# EAGLE design Program-Counter (EAGLE 9.6.2)
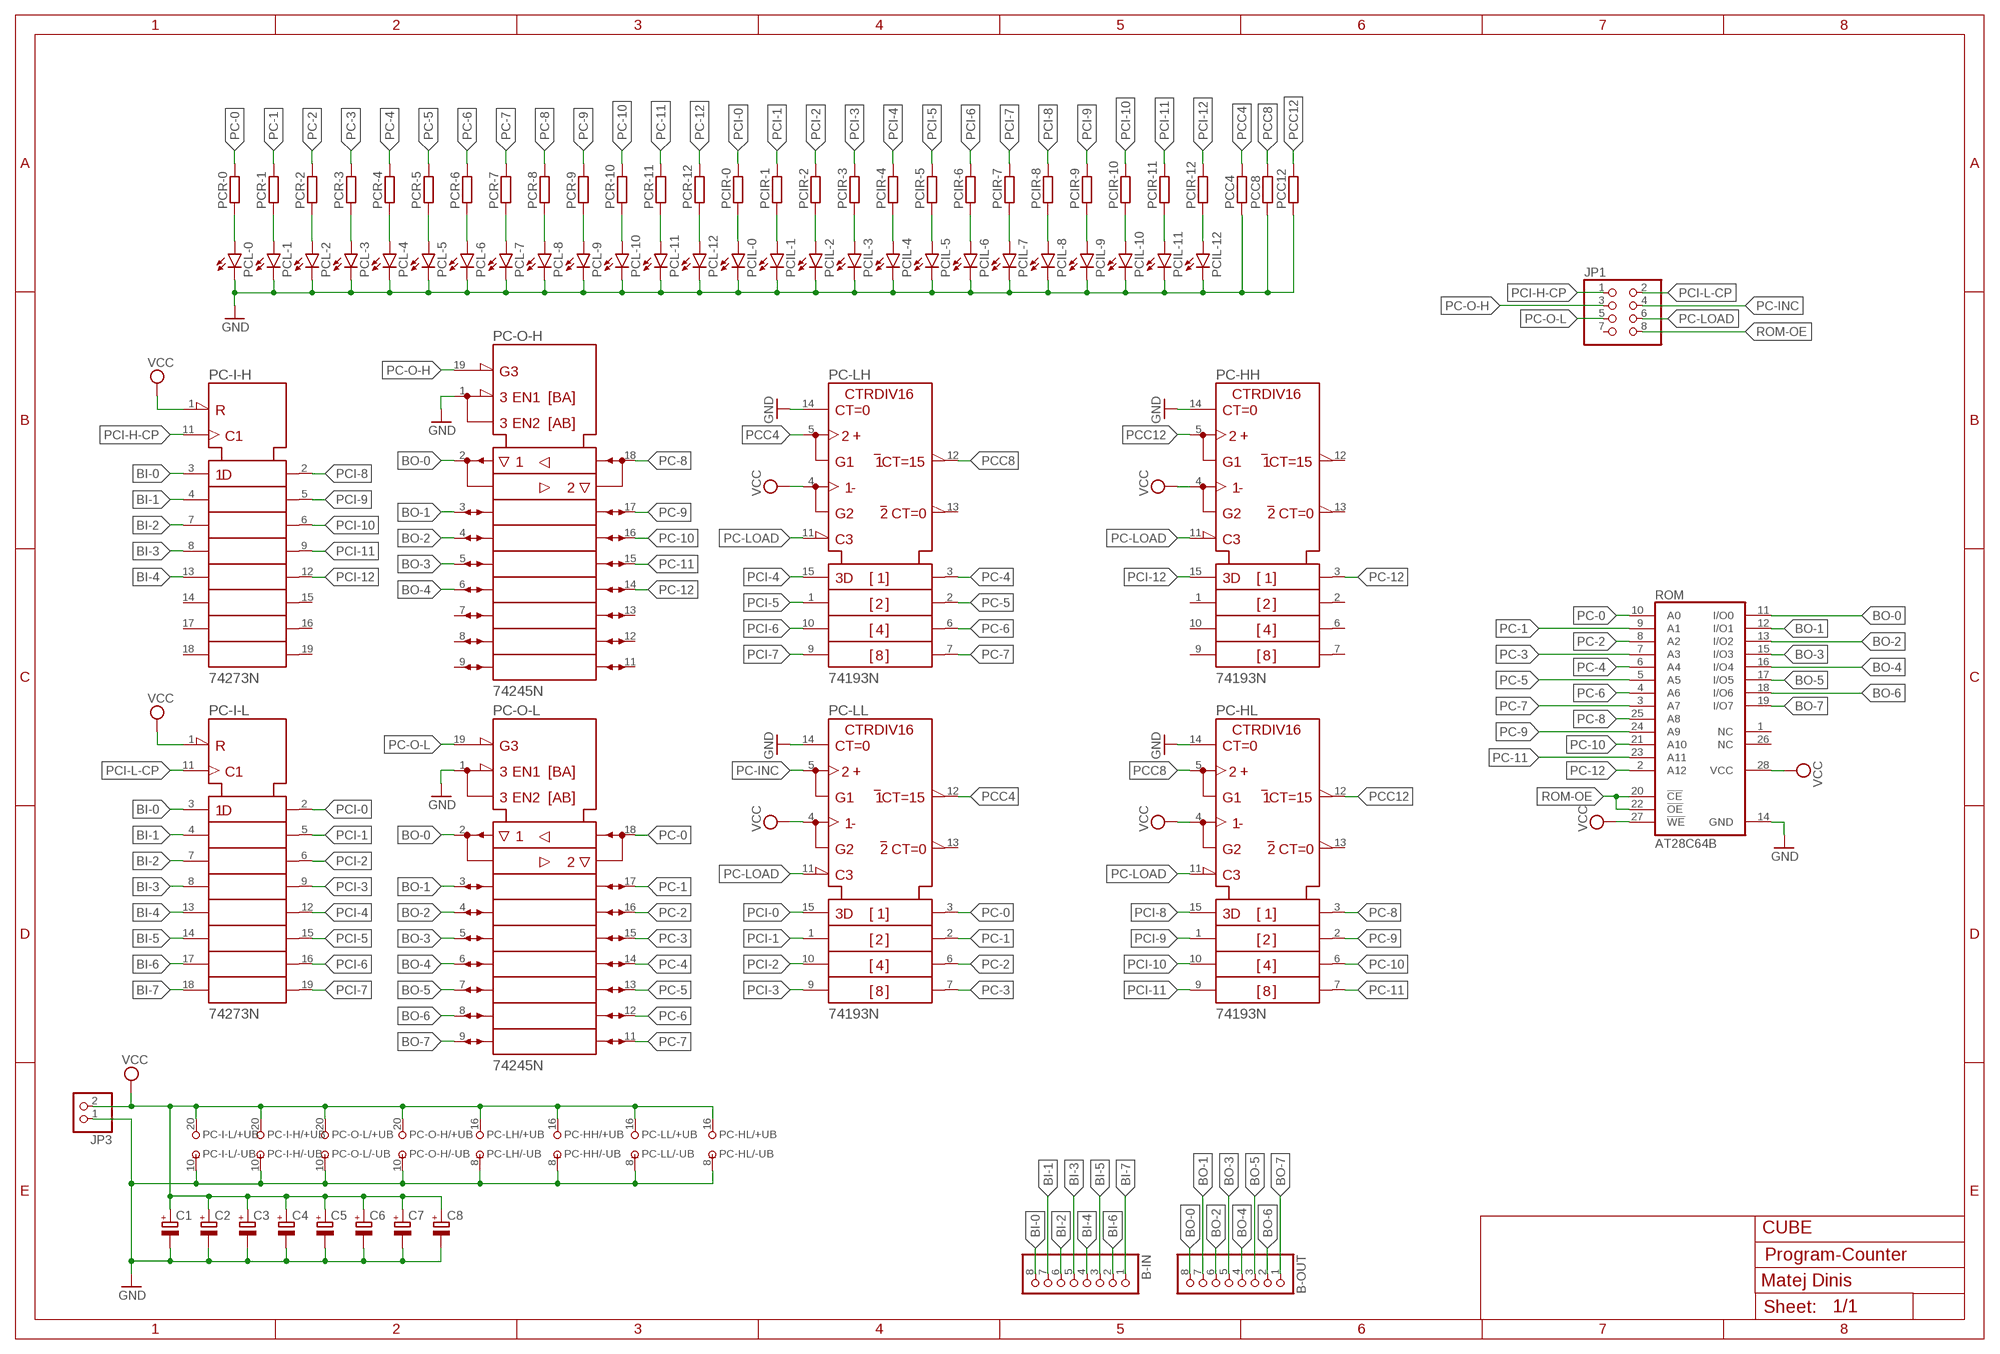
[diagram p0: schematic, sheet 1]

## Parts
B-IN  PINHD-1X8  [1X08]
B-OUT  PINHD-1X8  [1X08]
C1  CPOL-EUE3.5-8  [E3,5-8]
C2  CPOL-EUE3.5-8  [E3,5-8]
C3  CPOL-EUE3.5-8  [E3,5-8]
C4  CPOL-EUE3.5-8  [E3,5-8]
C5  CPOL-EUE3.5-8  [E3,5-8]
C6  CPOL-EUE3.5-8  [E3,5-8]
C7  CPOL-EUE3.5-8  [E3,5-8]
C8  CPOL-EUE3.5-8  [E3,5-8]
JP1  PINHD-2X4  [2X04]
JP3  PINHD-1X2  [1X02]
PC-HH  74193N  [DIL16]
PC-HL  74193N  [DIL16]
PC-I-H  74273N  [DIL20]
PC-I-L  74273N  [DIL20]
PC-LH  74193N  [DIL16]
PC-LL  74193N  [DIL16]
PC-O-H  74245N  [DIL20]
PC-O-L  74245N  [DIL20]
PCC4  R-EU_0207/10  [0207/10]
PCC8  R-EU_0207/10  [0207/10]
PCC12  R-EU_0207/10  [0207/10]
PCIL-0  LED5MM  [LED5MM]
PCIL-1  LED5MM  [LED5MM]
PCIL-2  LED5MM  [LED5MM]
PCIL-3  LED5MM  [LED5MM]
PCIL-4  LED5MM  [LED5MM]
PCIL-5  LED5MM  [LED5MM]
PCIL-6  LED5MM  [LED5MM]
PCIL-7  LED5MM  [LED5MM]
PCIL-8  LED5MM  [LED5MM]
PCIL-9  LED5MM  [LED5MM]
PCIL-10  LED5MM  [LED5MM]
PCIL-11  LED5MM  [LED5MM]
PCIL-12  LED5MM  [LED5MM]
PCIR-0  R-EU_0207/10  [0207/10]
PCIR-1  R-EU_0207/10  [0207/10]
PCIR-2  R-EU_0207/10  [0207/10]
PCIR-3  R-EU_0207/10  [0207/10]
PCIR-4  R-EU_0207/10  [0207/10]
PCIR-5  R-EU_0207/10  [0207/10]
PCIR-6  R-EU_0207/10  [0207/10]
PCIR-7  R-EU_0207/10  [0207/10]
PCIR-8  R-EU_0207/10  [0207/10]
PCIR-9  R-EU_0207/10  [0207/10]
PCIR-10  R-EU_0207/10  [0207/10]
PCIR-11  R-EU_0207/10  [0207/10]
PCIR-12  R-EU_0207/10  [0207/10]
PCL-0  LED5MM  [LED5MM]
PCL-1  LED5MM  [LED5MM]
PCL-2  LED5MM  [LED5MM]
PCL-3  LED5MM  [LED5MM]
PCL-4  LED5MM  [LED5MM]
PCL-5  LED5MM  [LED5MM]
PCL-6  LED5MM  [LED5MM]
PCL-7  LED5MM  [LED5MM]
PCL-8  LED5MM  [LED5MM]
PCL-9  LED5MM  [LED5MM]
PCL-10  LED5MM  [LED5MM]
PCL-11  LED5MM  [LED5MM]
PCL-12  LED5MM  [LED5MM]
PCR-0  R-EU_0207/10  [0207/10]
PCR-1  R-EU_0207/10  [0207/10]
PCR-2  R-EU_0207/10  [0207/10]
PCR-3  R-EU_0207/10  [0207/10]
PCR-4  R-EU_0207/10  [0207/10]
PCR-5  R-EU_0207/10  [0207/10]
PCR-6  R-EU_0207/10  [0207/10]
PCR-7  R-EU_0207/10  [0207/10]
PCR-8  R-EU_0207/10  [0207/10]
PCR-9  R-EU_0207/10  [0207/10]
PCR-10  R-EU_0207/10  [0207/10]
PCR-11  R-EU_0207/10  [0207/10]
PCR-12  R-EU_0207/10  [0207/10]
ROM  AT28C64B  28C64C  [DIL28-6]

## Nets
BI-0: B-IN.8 PC-I-H.3(1D) PC-I-L.3(1D)
BI-1: B-IN.7 PC-I-H.4(2D) PC-I-L.4(2D)
BI-2: B-IN.6 PC-I-H.7(3D) PC-I-L.7(3D)
BI-3: B-IN.5 PC-I-H.8(4D) PC-I-L.8(4D)
BI-4: B-IN.4 PC-I-H.13(5D) PC-I-L.13(5D)
BI-5: B-IN.3 PC-I-L.14(6D)
BI-6: B-IN.2 PC-I-L.17(7D)
BI-7: B-IN.1 PC-I-L.18(8D)
BO-0: B-OUT.8 PC-O-H.2(A1) PC-O-L.2(A1) ROM.11(I/O0)
BO-1: B-OUT.7 PC-O-H.3(A2) PC-O-L.3(A2) ROM.12(I/O1)
BO-2: B-OUT.6 PC-O-H.4(A3) PC-O-L.4(A3) ROM.13(I/O2)
BO-3: B-OUT.5 PC-O-H.5(A4) PC-O-L.5(A4) ROM.15(I/O3)
BO-4: B-OUT.4 PC-O-H.6(A5) PC-O-L.6(A5) ROM.16(I/O4)
BO-5: B-OUT.3 PC-O-L.7(A6) ROM.17(I/O5)
BO-6: B-OUT.2 PC-O-L.8(A7) ROM.18(I/O6)
BO-7: B-OUT.1 PC-O-L.9(A8) ROM.19(I/O7)
GND: C1.- C2.- C3.- C4.- C5.- C6.- C7.- C8.- JP3.1 PC-HH.8(-UB) PC-HH.14(CLR) PC-HL.8(-UB) PC-HL.14(CLR) PC-I-H.10(-UB) PC-I-L.10(-UB) PC-LH.8(-UB) PC-LH.14(CLR) PC-LL.8(-UB) PC-LL.14(CLR) PC-O-H.1(DIR) PC-O-H.10(-UB) PC-O-L.1(DIR) PC-O-L.10(-UB) PCC4.1 PCC8.1 PCC12.1 PCIL-0.K(C) PCIL-1.K(C) PCIL-2.K(C) PCIL-3.K(C) PCIL-4.K(C) PCIL-5.K(C) PCIL-6.K(C) PCIL-7.K(C) PCIL-8.K(C) PCIL-9.K(C) PCIL-10.K(C) PCIL-11.K(C) PCIL-12.K(C) PCL-0.K(C) PCL-1.K(C) PCL-2.K(C) PCL-3.K(C) PCL-4.K(C) PCL-5.K(C) PCL-6.K(C) PCL-7.K(C) PCL-8.K(C) PCL-9.K(C) PCL-10.K(C) PCL-11.K(C) PCL-12.K(C) ROM.14(GND)
N$1: PCL-0.A PCR-0.1
N$4: PCL-1.A PCR-1.1
N$7: PCL-2.A PCR-2.1
N$10: PCL-3.A PCR-3.1
N$13: PCL-4.A PCR-4.1
N$16: PCL-5.A PCR-5.1
N$21: PCL-6.A PCR-6.1
N$24: PCL-7.A PCR-7.1
N$27: PCL-8.A PCR-8.1
N$30: PCL-9.A PCR-9.1
N$33: PCL-10.A PCR-10.1
N$38: PCL-11.A PCR-11.1
N$41: PCL-12.A PCR-12.1
N$44: PCIL-0.A PCIR-0.1
N$47: PCIL-1.A PCIR-1.1
N$50: PCIL-2.A PCIR-2.1
N$55: PCIL-3.A PCIR-3.1
N$58: PCIL-4.A PCIR-4.1
N$61: PCIL-5.A PCIR-5.1
N$64: PCIL-6.A PCIR-6.1
N$67: PCIL-7.A PCIR-7.1
N$70: PCIL-8.A PCIR-8.1
N$73: PCIL-9.A PCIR-9.1
N$76: PCIL-10.A PCIR-10.1
N$79: PCIL-11.A PCIR-11.1
N$82: PCIL-12.A PCIR-12.1
PC-0: PC-LL.3(QA) PC-O-L.18(B1) PCR-0.2 ROM.10(A0)
PC-1: PC-LL.2(QB) PC-O-L.17(B2) PCR-1.2 ROM.9(A1)
PC-2: PC-LL.6(QC) PC-O-L.16(B3) PCR-2.2 ROM.8(A2)
PC-3: PC-LL.7(QD) PC-O-L.15(B4) PCR-3.2 ROM.7(A3)
PC-4: PC-LH.3(QA) PC-O-L.14(B5) PCR-4.2 ROM.6(A4)
PC-5: PC-LH.2(QB) PC-O-L.13(B6) PCR-5.2 ROM.5(A5)
PC-6: PC-LH.6(QC) PC-O-L.12(B7) PCR-6.2 ROM.4(A6)
PC-7: PC-LH.7(QD) PC-O-L.11(B8) PCR-7.2 ROM.3(A7)
PC-8: PC-HL.3(QA) PC-O-H.18(B1) PCR-8.2 ROM.25(A8)
PC-9: PC-HL.2(QB) PC-O-H.17(B2) PCR-9.2 ROM.24(A9)
PC-10: PC-HL.6(QC) PC-O-H.16(B3) PCR-10.2 ROM.21(A10)
PC-11: PC-HL.7(QD) PC-O-H.15(B4) PCR-11.2 ROM.23(A11)
PC-12: PC-HH.3(QA) PC-O-H.14(B5) PCR-12.2 ROM.2(A12)
PC-INC: JP1.4 PC-LL.5(UP)
PC-LOAD: JP1.6 PC-HH.11(!LOAD) PC-HL.11(!LOAD) PC-LH.11(!LOAD) PC-LL.11(!LOAD)
PC-O-H: JP1.3 PC-O-H.19(!G)
PC-O-L: JP1.5 PC-O-L.19(!G)
PCC4: PC-LH.5(UP) PC-LL.12(!CO) PCC4.2
PCC8: PC-HL.5(UP) PC-LH.12(!CO) PCC8.2
PCC12: PC-HH.5(UP) PC-HL.12(!CO) PCC12.2
PCI-0: PC-I-L.2(1Q) PC-LL.15(A) PCIR-0.2
PCI-1: PC-I-L.5(2Q) PC-LL.1(B) PCIR-1.2
PCI-2: PC-I-L.6(3Q) PC-LL.10(C) PCIR-2.2
PCI-3: PC-I-L.9(4Q) PC-LL.9(D) PCIR-3.2
PCI-4: PC-I-L.12(5Q) PC-LH.15(A) PCIR-4.2
PCI-5: PC-I-L.15(6Q) PC-LH.1(B) PCIR-5.2
PCI-6: PC-I-L.16(7Q) PC-LH.10(C) PCIR-6.2
PCI-7: PC-I-L.19(8Q) PC-LH.9(D) PCIR-7.2
PCI-8: PC-HL.15(A) PC-I-H.2(1Q) PCIR-8.2
PCI-9: PC-HL.1(B) PC-I-H.5(2Q) PCIR-9.2
PCI-10: PC-HL.10(C) PC-I-H.6(3Q) PCIR-10.2
PCI-11: PC-HL.9(D) PC-I-H.9(4Q) PCIR-11.2
PCI-12: PC-HH.15(A) PC-I-H.12(5Q) PCIR-12.2
PCI-H-CP: JP1.1 PC-I-H.11(CLK)
PCI-L-CP: JP1.2 PC-I-L.11(CLK)
ROM-OE: JP1.8 ROM.20(!CE) ROM.22(!OE)
VCC: C1.+ C2.+ C3.+ C4.+ C5.+ C6.+ C7.+ C8.+ JP3.2 PC-HH.4(DOWN) PC-HH.16(+UB) PC-HL.4(DOWN) PC-HL.16(+UB) PC-I-H.1(!CLR) PC-I-H.20(+UB) PC-I-L.1(!CLR) PC-I-L.20(+UB) PC-LH.4(DOWN) PC-LH.16(+UB) PC-LL.4(DOWN) PC-LL.16(+UB) PC-O-H.20(+UB) PC-O-L.20(+UB) ROM.27(!WE) ROM.28(VCC)
Unconnected: JP1.7 PC-HH.1(B) PC-HH.2(QB) PC-HH.6(QC) PC-HH.7(QD) PC-HH.9(D) PC-HH.10(C) PC-HH.12(!CO) PC-HH.13(!BO) PC-HL.13(!BO) PC-I-H.14(6D) PC-I-H.15(6Q) PC-I-H.16(7Q) PC-I-H.17(7D) PC-I-H.18(8D) PC-I-H.19(8Q) PC-LH.13(!BO) PC-LL.13(!BO) PC-O-H.7(A6) PC-O-H.8(A7) PC-O-H.9(A8) PC-O-H.11(B8) PC-O-H.12(B7) PC-O-H.13(B6) ROM.1(NC) ROM.26(NC)

## Notes on the sheet
- CUBE
- Matej Dinis

## Library data of the parts
B-IN B-OUT = pinhead:PINHD-1X8: PIN HEADER
C1-C8 = rcl:CPOL-EU: POLARIZED CAPACITOR, European symbol; SPICEPREFIX: C
JP1 = pinhead:PINHD-2X4: PIN HEADER
JP3 = pinhead:PINHD-1X2: PIN HEADER
PC-HH PC-HL PC-LH PC-LL = 74ttl-din:74*193: Synchronus 4-bit up down COUNTER
PC-I-H PC-I-L = 74ttl-din:74*273: Octal D type FLIP FLOP, clear
PC-O-H PC-O-L = 74ttl-din:74*245: Octal BUS TRANSCEIVER, 3-state
PCC4 PCC8 PCC12 PCIR-0 PCIR-1-PCIR-12 PCR-0 PCR-1-PCR-12 = rcl:R-EU_: RESISTOR, European symbol; SPICEPREFIX: R
PCIL-0 PCIL-1-PCIL-12 PCL-0 PCL-1-PCL-12 = led:LED: LED OSRAM: - CHIPLED LG R971, LG N971, LY N971, LG Q971, LY Q971, LO R971, LY R971 LH N974, LH R974 LS Q976, LO Q976, LY Q976 LO Q996 - Hyper CHIPLED LW Q18S LB Q993, LB Q99A, LB R99A - SideLED LS A670, LO A670, LY A670, LG A670, LP A670 LB A673, LV A673, LT A673, LW A673 LH A674 LY A675 LS A676, LA A676, LO A676, LY A676, LW A676 LS A679, LY A679, LG A679 - Hyper Micro SIDELED® LS Y876, LA Y876, LO Y876, LY Y876 LT Y87S - SmartLED LW L88C, LW L88S LB L89C, LB L89S, LG L890 LS L89K, LO L89K, LY L89K LS L896, LA L896, LO L896, LY L896 - TOPLED LS T670, LO T670, LY T670, LG T670, LP T670 LSG T670, LSP T670, LSY T670, LOP T670, LYG T670 LG T671, LOG T671, LSG T671 LB T673, LV T673, LT T673, LW T673 LH T674 LS T676, LA T676, LO T676, LY T676, LB T676, LH T676, LSB T676, LW T676 LB T67C, LV T67C, LT T67C, LS T67K, LO T67K, LY T67K, LW E67C LS E67B, LA E67B, LO E67B, LY E67B, LB E67C, LV E67C, LT E67C LW T67C LS T679, LY T679, LG T679 LS T770, LO T770, LY T770, LG T770, LP T770 LB T773, LV T773, LT T773, LW T773 LH T774 LS E675, LA E675, LY E675, LS T675 LS T776, LA T776, LO T776, LY T776, LB T776 LHGB T686 LT T68C, LB T68C - Hyper Mini TOPLED® LB M676 - Mini TOPLED Santana® LG M470 LS M47K, LO M47K, LY M47K Source: http://www.osram.convergy.de LUXEON: - LUMILED® LXK2-PW12-R00, LXK2-PW12-S00, LXK2-PW14-U00, LXK2-PW14-V00 LXK2-PM12-R00, LXK2-PM12-S00, LXK2-PM14-U00 LXK2-PE12-Q00, LXK2-PE12-R00, LXK2-PE12-S00, LXK2-PE14-T00, LXK2-PE14-U00 LXK2-PB12-K00, LXK2-PB12-L00, LXK2-PB12-M00, LXK2-PB14-N00, LXK2-PB14-P00, LXK2-PB14-Q00 LXK2-PR12-L00, LXK2-PR12-M00, LXK2-PR14-Q00, LXK2-PR14-R00 LXK2-PD12-Q00, LXK2-PD12-R00, LXK2-PD12-S00 LXK2-PH12-R00, LXK2-PH12-S00 LXK2-PL12-P00, LXK2-PL12-Q00, LXK2-PL12-R00 Source: www.luxeon.com KINGBRIGHT: KA-3528ASYC Source: www.kingbright.com
ROM = memory-nec:28C64C: MEMORY; MPN: AT28C64B-15PU; OC_FARNELL: 1095784; OC_NEWARK: 96K6557

## Board
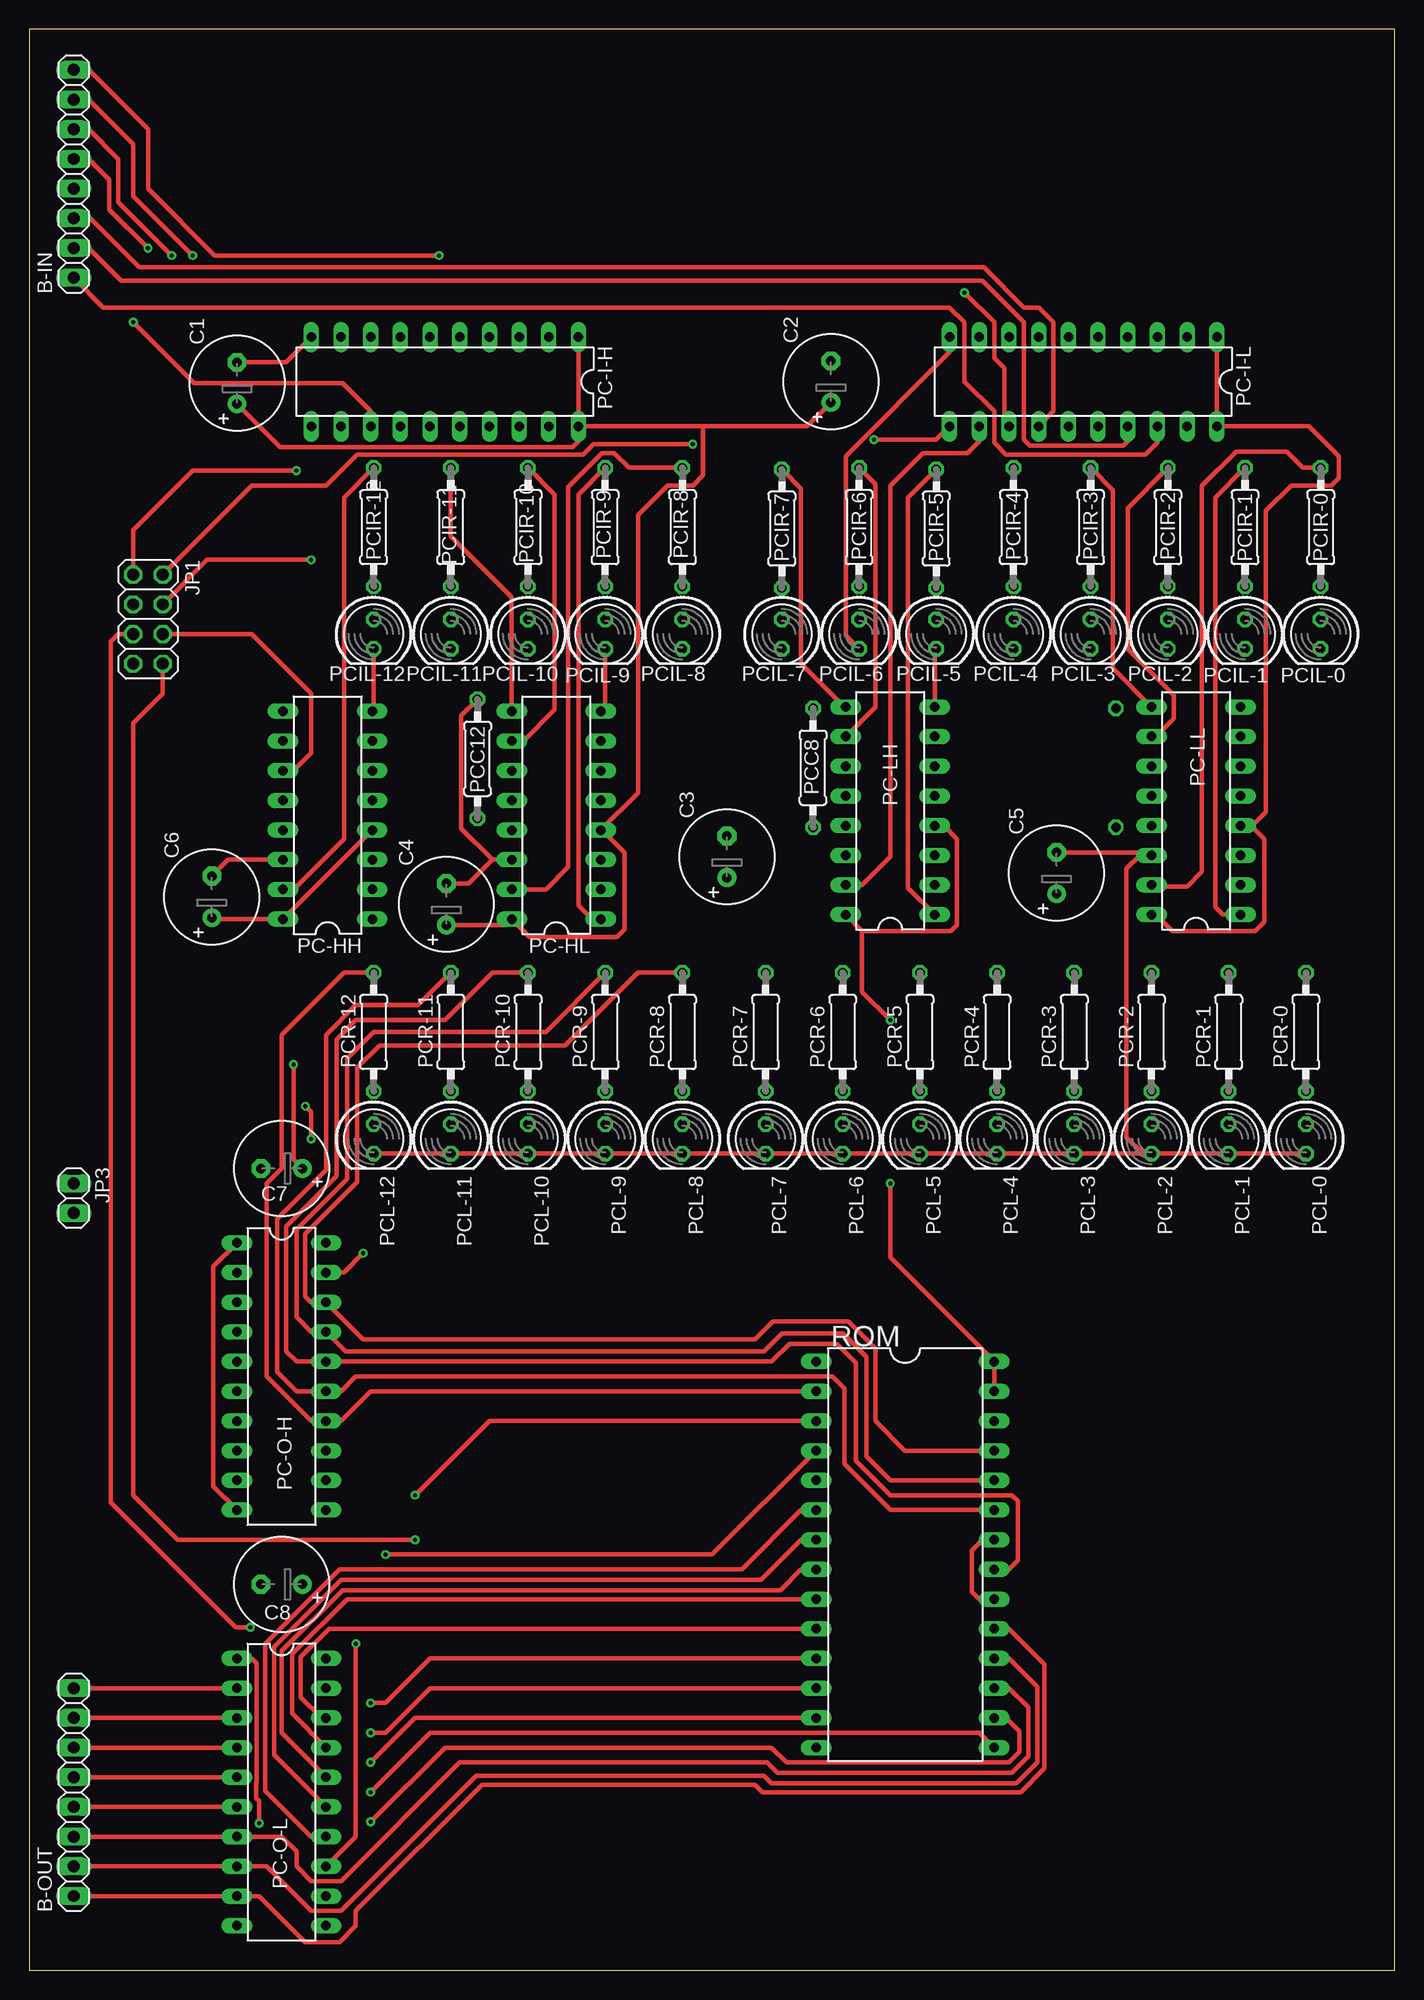
[diagram p1: board, top side]
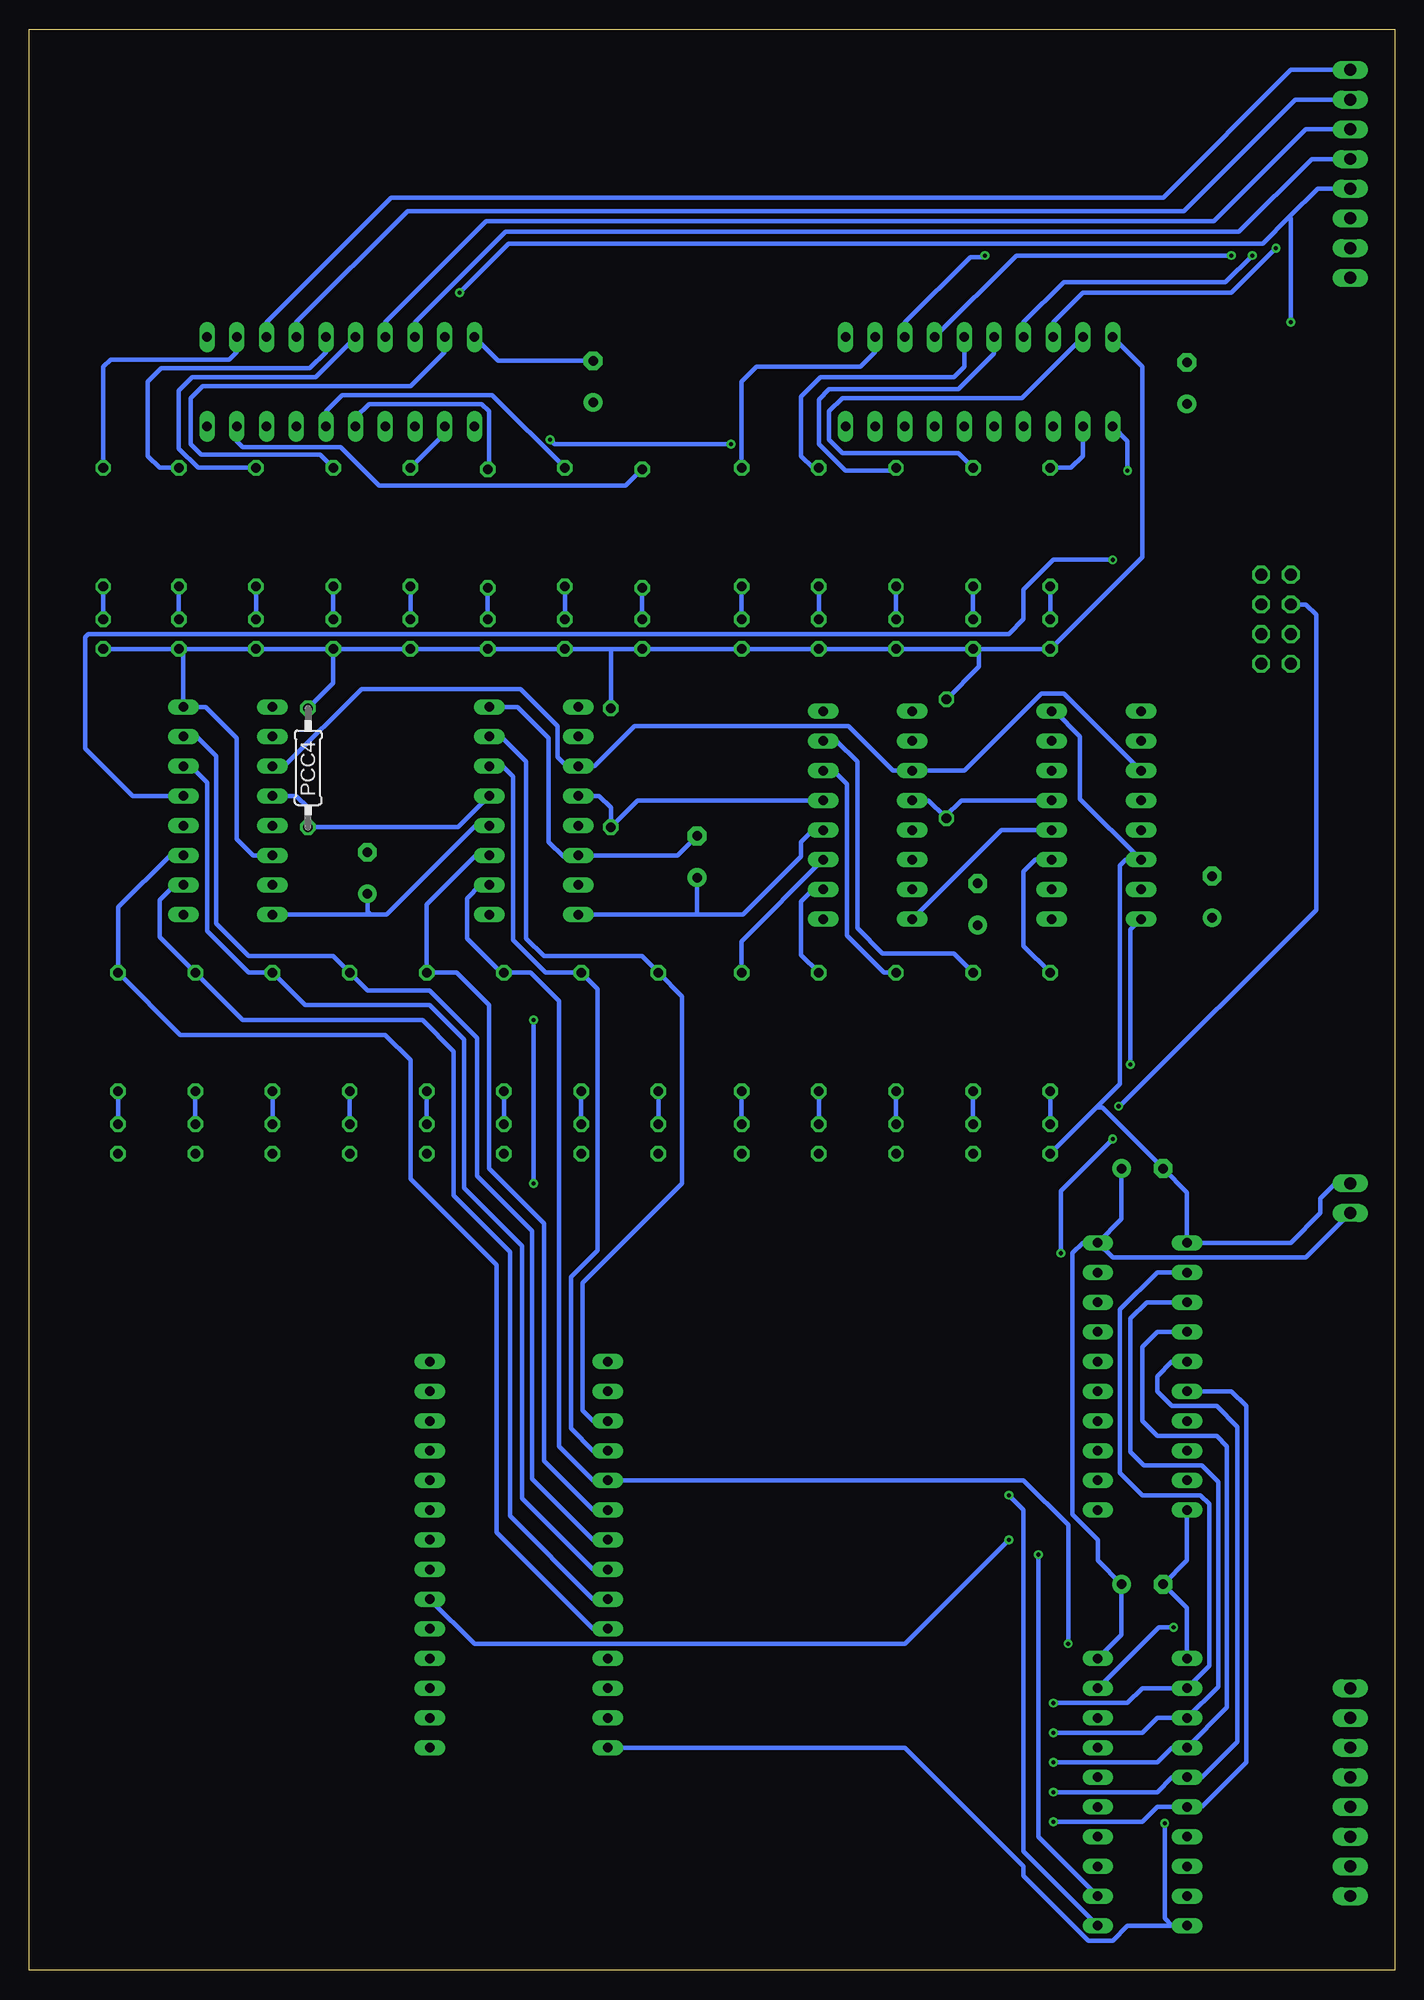
[diagram p2: board, bottom side, seen from below]

Size 116.82 x 166.04 mm. Coordinates in mm from the lower left corner, seen from the top.
Outline: 0,0 116.82,0 116.82,166.04 0,166.04 0,0
Copper layers (1*16): Top 0.035mm / dielectric 1.5mm / Bottom 0.035mm
Design rules "default": minimum track width 6mil, minimum drill 0.35mm, track to track 6mil, track to pad 6mil, pad to pad 6mil, via to via 6mil, smd to smd 6mil, copper to edge 40mil, drill to drill 6mil, minimum pad ring 10mil, minimum via ring 8mil, stop-mask expansion 4mil, vias tented up to drill 0mil, thermal gap 10mil

### Footprints (pad centres in the part's own frame; a part is rotated, then mirrored left to right if it is on the bottom)
1X08 = drill 1.016 long: 1 -8.89,0; 2 -6.35,0; 3 -3.81,0; 4 -1.27,0; 5 1.27,0; 6 3.81,0; 7 6.35,0; 8 8.89,0
E3,5-8 = drill 0.813 pad 1.6: + -1.778,0 | drill 0.813 pad 1.6 octagon: - 1.778,0
2X04 = drill 1.016 octagon: 1 -3.81,-1.27; 2 -3.81,1.27; 3 -1.27,-1.27; 4 -1.27,1.27; 5 1.27,-1.27; 6 1.27,1.27; 7 3.81,-1.27; 8 3.81,1.27
1X02 = drill 1.016 long: 1 -1.27,0; 2 1.27,0
DIL16 = drill 0.813 long: 1 -8.89,-3.81; 2 -6.35,-3.81; 3 -3.81,-3.81; 4 -1.27,-3.81; 5 1.27,-3.81; 6 3.81,-3.81; 7 6.35,-3.81; 8 8.89,-3.81; 9 8.89,3.81; 10 6.35,3.81; 11 3.81,3.81; 12 1.27,3.81; 13 -1.27,3.81; 14 -3.81,3.81; 15 -6.35,3.81; 16 -8.89,3.81
DIL20 = drill 0.813 long: 1 -11.43,-3.81; 2 -8.89,-3.81; 3 -6.35,-3.81; 4 -3.81,-3.81; 5 -1.27,-3.81; 6 1.27,-3.81; 7 3.81,-3.81; 8 6.35,-3.81; 9 8.89,-3.81; 10 11.43,-3.81; 11 11.43,3.81; 12 8.89,3.81; 13 6.35,3.81; 14 3.81,3.81; 15 1.27,3.81; 16 -1.27,3.81; 17 -3.81,3.81; 18 -6.35,3.81; 19 -8.89,3.81; 20 -11.43,3.81
0207/10 = drill 0.813 octagon: 1 -5.08,0; 2 5.08,0
LED5MM = drill 0.813 octagon: A -1.27,0; K 1.27,0
DIL28-6 = drill 0.813 long: 1 -16.51,-7.62; 2 -13.97,-7.62; 3 -11.43,-7.62; 4 -8.89,-7.62; 5 -6.35,-7.62; 6 -3.81,-7.62; 7 -1.27,-7.62; 8 1.27,-7.62; 9 3.81,-7.62; 10 6.35,-7.62; 11 8.89,-7.62; 12 11.43,-7.62; 13 13.97,-7.62; 14 16.51,-7.62; 15 16.51,7.62; 16 13.97,7.62; 17 11.43,7.62; 18 8.89,7.62; 19 6.35,7.62; 20 3.81,7.62; 21 1.27,7.62; 22 -1.27,7.62; 23 -3.81,7.62; 24 -6.35,7.62; 25 -8.89,7.62; 26 -11.43,7.62; 27 -13.97,7.62; 28 -16.51,7.62

### Placement (x,y rotation side)
B-IN  3.81,153.67 90 top
B-OUT  3.81,15.24 90 top
C1  17.78,135.76 90 top
C2  68.58,135.89 90 top
C3  59.69,95.25 90 top
C4  35.69,91.19 90 top
C5  87.88,93.85 90 top
C6  15.62,91.82 90 top
C7  21.59,68.58 180 top
C8  21.59,33.02 180 top
JP1  10.16,115.57 270 top
JP3  3.81,66.04 270 top
PC-HH  25.53,98.81 90 top
PC-HL  45.09,98.81 90 top
PC-I-H  35.56,135.89 180 top
PC-I-L  90.17,135.89 180 top
PC-LH  73.66,99.19 90 top
PC-LL  99.82,99.19 90 top
PC-O-H  21.59,50.8 270 top
PC-O-L  21.59,15.24 270 top
PCC4  92.96,102.87 270 bottom
PCC8  67.06,102.87 270 top
PCC12  38.35,103.63 270 top
PCIL-0  110.49,114.3 270 top
PCIL-1  104.01,114.3 270 top
PCIL-2  97.41,114.3 270 top
PCIL-3  90.81,114.3 270 top
PCIL-4  84.2,114.3 270 top
PCIL-5  77.6,114.3 270 top
PCIL-6  70.99,114.3 270 top
PCIL-7  64.39,114.3 270 top
PCIL-8  55.88,114.3 270 top
PCIL-9  49.28,114.3 270 top
PCIL-10  42.67,114.3 270 top
PCIL-11  36.07,114.3 270 top
PCIL-12  29.46,114.3 270 top
PCIR-0  110.49,123.44 90 top
PCIR-1  104.01,123.44 90 top
PCIR-2  97.41,123.44 90 top
PCIR-3  90.81,123.44 90 top
PCIR-4  84.2,123.44 90 top
PCIR-5  77.6,123.32 90 top
PCIR-6  70.99,123.44 90 top
PCIR-7  64.39,123.32 90 top
PCIR-8  55.88,123.44 90 top
PCIR-9  49.28,123.44 90 top
PCIR-10  42.67,123.44 90 top
PCIR-11  36.07,123.44 90 top
PCIR-12  29.46,123.44 90 top
PCL-0  109.22,71.12 270 top
PCL-1  102.62,71.12 270 top
PCL-2  96.01,71.12 270 top
PCL-3  89.41,71.12 270 top
PCL-4  82.8,71.12 270 top
PCL-5  76.2,71.12 270 top
PCL-6  69.6,71.12 270 top
PCL-7  62.99,71.12 270 top
PCL-8  55.88,71.12 270 top
PCL-9  49.28,71.12 270 top
PCL-10  42.67,71.12 270 top
PCL-11  36.07,71.12 270 top
PCL-12  29.46,71.12 270 top
PCR-0  109.22,80.26 90 top
PCR-1  102.62,80.26 90 top
PCR-2  96.01,80.26 90 top
PCR-3  89.41,80.26 90 top
PCR-4  82.8,80.26 90 top
PCR-5  76.2,80.26 90 top
PCR-6  69.6,80.26 90 top
PCR-7  62.99,80.26 90 top
PCR-8  55.88,80.26 90 top
PCR-9  49.28,80.26 90 top
PCR-10  42.67,80.26 90 top
PCR-11  36.07,80.26 90 top
PCR-12  29.46,80.26 90 top
ROM  74.93,35.56 270 top

### Tracks (layer width: path | path; a pad name or v marks a point on that pad's centre or on a via)
BI-0  (via drill 0.35)
  Top 0.4: v35.05,146.69 15.88,146.69 10.16,152.4 10.16,157.48 5.08,162.56 B-IN.8
  Bottom 0.4: B-IN.8 8.89,162.56 19.81,151.64 85.85,151.64 96.52,140.97 PC-I-L.3 | PC-I-H.3 41.91,140.97 36.32,146.56 35.18,146.56 v35.05,146.69
BI-1  (via drill 0.35)
  Top 0.4: B-IN.7 5.08,160.02 8.89,156.21 8.89,151.76 v13.97,146.69
  Bottom 0.4: PC-I-L.4 93.98,140.97 84.45,150.5 18.03,150.5 8.51,160.02 B-IN.7 | v13.97,146.69 32.38,146.69 PC-I-H.4
BI-2  (via drill 0.35)
  Top 0.4: v12.19,146.69 7.62,151.26 7.62,154.94 5.08,157.48 B-IN.6
  Bottom 0.4: B-IN.6 7.62,157.48 15.49,149.61 77.72,149.61 86.36,140.97 PC-I-L.7 | PC-I-H.7 31.75,140.97 28.32,144.4 14.48,144.4 v12.19,146.69
BI-3  (via drill 0.35)
  Top 0.4: B-IN.5 5.08,154.94 6.86,153.16 6.86,150.62 v10.16,147.32
  Bottom 0.4: PC-I-L.8 83.82,140.97 76.07,148.72 13.34,148.72 7.11,154.94 B-IN.5 | PC-I-H.8 29.21,140.97 26.67,143.51 13.97,143.51 v10.16,147.32
BI-4  (via drill 0.35)
  Top 0.4: PC-I-L.13 83.44,132.46 83.44,137.03 82.55,137.92 82.55,140.97 v80.01,143.51 | PC-I-H.13 29.21,133.35 26.8,135.76 14.1,135.76 v8.89,140.97
  Bottom 0.4: B-IN.4 6.6,152.4 9.02,149.99 | v80.01,143.51 75.82,147.7 11.3,147.7 9.02,149.99 | v8.89,140.97 8.89,149.86 9.02,149.99
BI-5
  Top 0.4: PC-I-L.14 87.63,133.35 87.63,140.97 86.36,142.24 85.09,142.24 81.66,145.67 9.4,145.67 5.21,149.86 B-IN.3
BI-6
  Top 0.4: PC-I-L.17 93.98,130.81 93.6,130.43 91.88,130.43 91.86,130.41 85.62,130.41 85.09,130.94 85.09,140.97 81.53,144.53 7.87,144.53 5.08,147.32 B-IN.2
BI-7
  Top 0.4: B-IN.1 6.35,142.24 78.74,142.24 80.01,140.97 80.01,135.89 82.55,133.35 82.55,130.68 83.57,129.67 95.5,129.67 96.52,130.68 PC-I-L.18
BO-0  (via drill 0.35)
  Top 0.4: v29.21,22.86 30.48,22.86 34.29,26.67 ROM.11 | PC-O-L.2 B-OUT.8
  Bottom 0.4: v29.21,22.86 22.86,22.86 21.59,24.13 PC-O-L.2 15.88,26.04 15.88,39.88 16.64,40.64 21.59,40.64 23.5,42.55 23.5,56.52 20.32,59.69 PC-O-H.2
BO-1  (via drill 0.35)
  Top 0.4: v29.21,20.32 30.48,20.32 34.29,24.13 ROM.12 | B-OUT.7 PC-O-L.3
  Bottom 0.4: v29.21,20.32 21.59,20.32 20.32,21.59 PC-O-L.3 15.11,24.26 15.11,41.78 16.51,43.18 21.46,43.18 22.61,44.32 22.61,55.75 21.21,57.15 PC-O-H.3
BO-2  (via drill 0.35)
  Top 0.4: ROM.13 33.02,21.59 v29.21,17.78 | PC-O-L.4 B-OUT.6
  Bottom 0.4: v29.21,17.78 20.32,17.78 19.05,19.05 PC-O-L.4 14.35,22.48 14.35,44.83 15.24,45.72 20.32,45.72 21.59,46.99 21.59,53.34 20.32,54.61 PC-O-H.4
BO-3  (via drill 0.35)
  Top 0.4: v29.21,15.24 34.29,20.32 81.28,20.32 ROM.15 | B-OUT.5 PC-O-L.5
  Bottom 0.4: v29.21,15.24 20.32,15.24 19.05,16.51 PC-O-L.5 16.51,16.51 13.46,19.56 13.46,46.48 15.24,48.26 19.05,48.26 20.32,49.53 20.32,50.8 19.05,52.07 PC-O-H.5
BO-4  (via drill 0.35)
  Top 0.4: v29.21,12.7 35.56,19.05 63.5,19.05 64.77,17.78 83.82,17.78 84.71,18.67 84.71,20.45 83.57,21.59 ROM.16 | PC-O-L.6 B-OUT.4
  Bottom 0.4: v29.21,12.7 21.59,12.7 20.32,13.97 PC-O-L.6 16.51,13.97 12.7,17.78 12.7,48.26 13.97,49.53 PC-O-H.6
BO-5
  Top 0.4: ROM.17 83.82,24.13 85.47,22.48 85.47,18.29 84.07,16.89 64.01,16.89 63.12,17.78 36.83,17.78 26.67,7.62 24.13,7.62 22.86,8.89 22.86,10.16 21.59,11.43 PC-O-L.7 B-OUT.3
BO-6
  Top 0.4: ROM.18 83.82,26.67 86.23,24.26 86.23,17.78 84.45,16 63.5,16 62.87,16.64 38.23,16.64 26.67,5.08 24.13,5.08 20.32,8.89 PC-O-L.8 B-OUT.2
BO-7
  Top 0.4: ROM.19 83.82,29.21 86.87,26.16 86.87,17.27 84.84,15.24 62.74,15.24 62.1,15.88 38.73,15.88 27.94,5.08 27.94,3.81 26.54,2.41 23.62,2.41 19.68,6.35 PC-O-L.9 B-OUT.1
GND  (via drill 0.35)
  Top 0.4: PCL-2.K 95.25,69.85 93.85,71.25 93.85,94.23 95,95.38 PC-LL.14 95.76,95.63 C5.- | PC-LH.8 77.47,112.9 PCIL-5.K | PC-I-L.10 78.74,138.43 69.85,129.54 69.85,114.17 PCIL-6.K | PC-HL.8 49.28,108.08 PCIL-9.K | PCIL-12.K 29.46,107.82 PC-HH.8 | PC-HL.14 39.62,95 | 39.62,95 36.96,97.66 36.96,107.31 PCC12.1 | C6.- 17.02,95 PC-HH.14 | C4.- 37.59,92.96 39.62,95 | C1.- 21.97,137.54 PC-I-H.10 | PCL-0.K PCL-1.K PCL-2.K | PCL-2.K PCL-3.K PCL-4.K PCL-5.K PCL-6.K PCL-7.K PCL-8.K PCL-9.K PCL-10.K PCL-11.K PCL-12.K | v19.68,12.57 19.68,14.48 19.43,14.73 19.43,16.07 19.45,16.09 19.45,26.27 19.05,26.67 PC-O-L.1 | PC-O-H.1 15.75,60.2 15.75,41.4 PC-O-H.10
  Bottom 0.4: PCIL-0.K PCIL-1.K | PCIL-1.K PCIL-2.K PCIL-3.K | PCIL-3.K PCIL-4.K PCIL-5.K | PCIL-5.K PCIL-6.K 67.18,113.03 | 67.18,113.03 PCIL-7.K PCIL-8.K PCIL-9.K PCIL-10.K PCIL-11.K 35.56,113.03 | PCC4.1 90.81,110.11 PCIL-3.K | PCIL-1.K 103.63,112.65 PC-LL.8 101.73,108.08 99.06,105.41 99.06,96.77 97.66,95.38 PC-LL.14 | 77.47,112.9 PCIL-5.K | PCC8.1 67.06,112.9 67.18,113.03 | PC-LH.8 75.06,108.08 72.39,105.41 72.39,96.52 71.12,95.25 69.98,95.25 PC-LH.14 61.34,95.38 C3.- | 35.56,113.03 PCIL-12.K 21.59,120.9 21.59,137.16 PC-I-H.10 | PCC12.1 35.56,111.51 35.56,113.03 | PC-HH.8 29.08,107.7 26.92,105.54 26.92,100.2 PC-HH.14 22.99,95 23.5,94.49 23.5,75.82 25.53,73.79 | 25.53,73.79 PCL-12.K | PC-I-L.10 76.71,137.67 C2.- | PC-O-L.1 17.78,30.99 C8.- 17.78,35.05 PC-O-H.10 | 25.53,73.79 25.02,73.79 C7.- 17.78,66.55 PC-O-H.1 8.89,62.23 6.35,64.77 6.35,66.04 5.08,67.31 JP3.1 | v19.68,12.57 19.68,4.45 19.05,3.81 PC-O-L.10 22.86,3.81 24.13,2.54 26.22,2.54 31.75,8.07 31.75,8.89 41.91,19.05 ROM.14
N$1
  Bottom 0.4: PCL-0.A PCR-0.1
N$4
  Bottom 0.4: PCR-1.1 PCL-1.A
N$7
  Bottom 0.4: PCL-2.A PCR-2.1
N$10
  Bottom 0.4: PCR-3.1 PCL-3.A
N$13
  Bottom 0.4: PCL-4.A PCR-4.1
N$16
  Bottom 0.4: PCR-5.1 PCL-5.A
N$21
  Bottom 0.4: PCL-6.A PCR-6.1
N$24
  Bottom 0.4: PCL-7.A PCR-7.1
N$27
  Bottom 0.4: PCL-8.A PCR-8.1
N$30
  Bottom 0.4: PCL-9.A PCR-9.1
N$33
  Bottom 0.4: PCR-10.1 PCL-10.A
N$38
  Bottom 0.4: PCR-11.1 PCL-11.A
N$41
  Bottom 0.4: PCR-12.1 PCL-12.A
N$44
  Bottom 0.4: PCIL-0.A PCIR-0.1
N$47
  Bottom 0.4: PCIR-1.1 PCIL-1.A
N$50
  Bottom 0.4: PCIL-2.A PCIR-2.1
N$55
  Bottom 0.4: PCIR-3.1 PCIL-3.A
N$58
  Bottom 0.4: PCIL-4.A PCIR-4.1
N$61
  Bottom 0.4: PCIR-5.1 PCIL-5.A
N$64
  Bottom 0.4: PCIL-6.A PCIR-6.1
N$67
  Bottom 0.4: PCIR-7.1 PCIL-7.A
N$70
  Bottom 0.4: PCIL-8.A PCIR-8.1
N$73
  Bottom 0.4: PCIR-9.1 PCIL-9.A
N$76
  Bottom 0.4: PCIL-10.A PCIR-10.1
N$79
  Bottom 0.4: PCIR-11.1 PCIL-11.A
N$82
  Bottom 0.4: PCIR-12.1 PCIL-12.A
PC-0
  Top 0.4: PC-O-L.18 25.02,21.59 23.24,23.37 23.24,26.8 25.65,29.21 ROM.10
  Bottom 0.4: PC-LL.3 104.78,95.38 109.22,90.93 PCR-0.2 103.89,80.01 86.36,80.01 84.2,77.85 84.2,67.69 76.83,60.33 76.83,37.47 68.58,29.21 ROM.10
PC-1
  Top 0.4: ROM.9 27.18,31.75 22.48,27.05 22.48,21.97 PC-O-L.17
  Bottom 0.4: PC-LL.2 104.39,92.84 105.66,91.57 105.66,88.39 PCR-1.2 98.55,81.28 83.19,81.28 80.52,78.61 80.52,66.29 75.69,61.47 75.69,38.86 68.58,31.75 ROM.9
PC-2
  Top 0.4: PC-O-L.16 21.59,20.32 21.59,27.3 26.8,32.51 64.26,32.51 66.04,34.29 ROM.8
  Bottom 0.4: PC-LL.6 103,103 101.6,101.6 101.6,88.9 98.04,85.34 PCR-2.2 93.22,82.55 82.55,82.55 79.63,79.63 79.63,66.93 74.68,61.98 74.68,40.39 68.58,34.29 ROM.8
PC-3
  Top 0.4: ROM.7 66.04,36.83 62.61,33.4 26.67,33.4 20.95,27.69 20.95,18.41 PC-O-L.15
  Bottom 0.4: PC-LL.7 102.49,105.54 100.84,103.89 100.84,89.53 98.04,86.74 90.81,86.74 PCR-3.2 87.88,83.82 82.55,83.82 78.49,79.76 78.49,67.94 73.79,63.25 73.79,42.04 68.58,36.83 ROM.7
PC-4
  Top 0.4: ROM.6 66.04,39.37 60.96,34.29 26.54,34.29 20.19,27.94 20.19,15.37 24.13,11.43 PC-O-L.14
  Bottom 0.4: PC-LH.3 78.61,95.38 82.8,91.19 PCR-4.2 80.26,85.34 77.47,82.55 77.47,68.58 72.77,63.88 72.77,43.56 68.58,39.37 ROM.6
PC-5  (via drill 0.35)
  Top 0.4: PC-O-L.13 27.94,11.43 v27.94,27.94
  Bottom 0.4: PC-LH.2 78.23,92.84 79.38,91.69 79.38,88.27 76.45,85.34 PCR-5.2 73.91,85.34 71.5,82.93 71.5,44.83 68.58,41.91 ROM.5 31.75,41.91 27.94,38.1 v27.94,27.94
PC-6  (via drill 0.35)
  Top 0.4: ROM.4 58.42,35.56 v30.48,35.56
  Bottom 0.4: PC-LH.6 76.33,103 75.44,102.11 75.44,88.14 72.64,85.34 PCR-6.2 68.2,83.95 68.2,61.59 70.48,59.31 70.48,46.35 68.58,44.45 ROM.4 | v30.48,35.56 30.48,11.43 PC-O-L.12
PC-7  (via drill 0.35)
  Top 0.4: v33.02,40.64 39.37,46.99 ROM.3
  Bottom 0.4: PC-LH.7 76.45,105.54 74.3,103.38 74.3,88.27 72.77,86.74 64.39,86.74 PCR-7.2 60.96,83.31 60.96,67.31 69.47,58.8 69.47,47.88 68.58,46.99 ROM.3 | PC-O-L.11 31.75,10.16 31.75,39.37 v33.02,40.64
PC-8
  Top 0.4: PCR-8.2 52.07,85.34 45.85,79.12 29.97,79.12 28.07,77.22 28.07,67.44 23.62,62.99 23.62,57.66 24.13,57.15 PC-O-H.18 28.57,53.98 62.1,53.98 63.63,55.5 70.1,55.5 72.39,53.21 72.39,46.99 74.93,44.45 ROM.25
  Bottom 0.4: PC-HL.3 55.88,88.01 PCR-8.2
PC-9
  Top 0.4: PCR-9.2 44.2,80.26 29.46,80.26 27.18,77.98 27.18,67.69 22.86,63.37 22.86,55.88 24.13,54.61 PC-O-H.17 27.05,52.96 62.87,52.96 64.39,54.48 69.6,54.48 71.63,52.45 71.63,43.94 73.66,41.91 ROM.24
  Bottom 0.4: PCR-9.2 50.8,86.87 50.8,91.44 49.78,92.46 PC-HL.2
PC-10
  Top 0.4: PCR-10.2 39.62,85.34 35.56,81.28 27.94,81.28 26.29,79.63 26.29,67.94 21.97,63.63 21.97,52.96 22.86,52.07 PC-O-H.16 63.5,52.07 65.02,53.59 69.09,53.59 70.74,51.94 70.74,43.56 73.66,40.64 84.07,40.64 84.58,40.13 84.58,35.05 83.82,34.29 ROM.21
  Bottom 0.4: PCR-10.2 43.69,85.34 46.86,88.52 46.86,101.47 48.01,102.62 PC-HL.6
PC-11
  Top 0.4: PCR-11.2 33.27,82.55 27.94,82.55 25.4,80.01 25.4,68.45 21.21,64.26 21.21,51.18 22.86,49.53 PC-O-H.15 26.67,49.53 27.94,50.8 68.71,50.8 69.72,49.78 69.72,43.31 73.66,39.37 ROM.23
  Bottom 0.4: PC-HL.7 47.75,105.16 45.97,103.38 45.97,89.15 43.81,87 37.72,87 PCR-11.2
PC-12
  Top 0.4: PCR-12.2 26.92,85.34 21.59,80.01 21.59,68.58 20.32,67.31 20.32,50.8 24.13,46.99 PC-O-H.14 26.67,46.99 29.21,49.53 ROM.2
  Bottom 0.4: PCR-12.2 31.75,87.63 31.75,93.98 30.73,95 PC-HH.3
PC-INC  (via drill 0.35)
  Top 0.4: JP1.4 15.24,120.65 v24.13,120.65
  Bottom 0.4: PC-LL.5 107.95,100.46 112.01,104.52 112.01,114.05 111.76,114.3 33.02,114.3 31.75,115.57 31.75,118.11 29.21,120.65 v24.13,120.65
PC-LOAD
  Top 0.4: JP1.6 19.05,114.3 24.13,109.22 24.13,104.14 22.61,102.62 PC-HH.11
  Bottom 0.4: PC-LL.11 95,103 88.39,109.6 74.8,109.6 71.63,106.43 71.63,103.76 70.87,103 PC-LH.11 68.45,103 65.02,106.43 46.74,106.43 42.93,102.62 PC-HL.11 36.83,102.62 30.23,109.22 28.32,109.22 PC-HH.11
PC-O-H  (via drill 0.35)
  Top 0.4: v23.62,73.91 24.13,73.41 v24.13,71.12 | v28.57,61.34 26.92,59.69 PC-O-H.19
  Bottom 0.4: JP1.3 7.62,116.84 6.73,115.95 6.73,90.68 23.5,73.91 v23.62,73.91 | v24.13,71.12 28.57,66.67 v28.57,61.34
PC-O-L  (via drill 0.35)
  Top 0.4: JP1.5 7.62,114.3 6.99,113.67 6.99,40.01 17.65,29.34 v18.92,29.34
  Bottom 0.4: v18.92,29.34 20.19,29.34 PC-O-L.19
PCC4
  Bottom 0.4: PC-LL.12 93.98,100.46 92.96,99.44 PCC4.2 80.14,97.79 PC-LH.5
PCC8
  Bottom 0.4: PC-LH.12 68.07,100.46 67.06,99.44 PCC8.2 64.77,100.08 PC-HL.5
PCC12
  Bottom 0.4: PCC12.2 38.48,98.68 | 38.48,98.68 39.88,100.08 PC-HL.12 | PC-HH.5 37.08,100.08 38.48,98.68
PCI-0
  Top 0.4: PCIR-0.2 108.97,128.52 107.57,129.92 103.25,129.92 100.33,127 100.33,93.98 99.06,92.71 96.14,92.71 PC-LL.15
  Bottom 0.4: PC-I-L.2 99.06,138.43 99.69,137.79 109.86,137.79 110.49,137.16 PCIR-0.2
PCI-1
  Top 0.4: PC-LL.1 102.11,90.3 101.47,90.93 101.47,125.98 PCIR-1.2
  Bottom 0.4: PC-I-L.5 91.44,138.43 92.84,137.03 105.54,137.03 106.68,135.89 106.68,129.54 105.66,128.52 PCIR-1.2
PCI-2
  Top 0.4: PCIR-2.2 93.98,125.09 93.98,113.03 97.92,109.09 97.92,107.06 96.39,105.54 PC-LL.10
  Bottom 0.4: PCIR-2.2 102.36,128.52 104.01,130.18 104.01,135.13 102.87,136.27 92.33,136.27 PC-I-L.6
PCI-3
  Top 0.4: PC-LL.9 92.71,111.38 92.71,126.62 PCIR-3.2
  Bottom 0.4: PC-I-L.9 81.28,138.43 84.2,135.51 101.98,135.51 103,134.49 103,130.56 102.11,129.67 91.95,129.67 PCIR-3.2
PCI-4
  Top 0.4: PC-LH.15 71.25,92.84 73.66,95.25 73.66,127 76.45,129.79 80.26,129.79 81.28,130.81 PC-I-L.12
  Bottom 0.4: PCIR-4.2 81.28,131.44 PC-I-L.12
PCI-5
  Top 0.4: PCIR-5.2 75.18,125.98 75.18,92.58 PC-LH.1
  Bottom 0.4: PCIR-5.2 77.47,128.52 77.47,133.35 78.11,133.99 87.76,133.99 88.9,132.84 PC-I-L.15
PCI-6
  Top 0.4: PCIR-6.2 72.39,127.13 72.39,108.08 PC-LH.10
  Bottom 0.4: PC-I-L.16 91.44,133.35 90.04,134.75 77.22,134.75 PCIR-6.2
PCI-7
  Top 0.4: PCIR-7.2 66.04,126.75 66.04,111.76 69.72,108.08 PC-LH.9
  Bottom 0.4: PC-I-L.19 99.06,130.81 98.55,130.3 90.17,130.3 86.87,127 65.79,127 PCIR-7.2
PCI-8
  Top 0.4: PCIR-8.2 51.31,128.52 50.04,129.79 49.02,129.79 46.1,126.87 46.1,94.36 44.2,92.46 PC-HL.15
  Bottom 0.4: PCIR-8.2 55.88,135.89 54.61,137.16 45.72,137.16 44.45,138.43 PC-I-H.2
PCI-9
  Top 0.4: PC-HL.1 48.13,89.92 46.99,91.06 46.99,126.24 PCIR-9.2
  Bottom 0.4: PC-I-H.5 36.83,137.16 37.72,136.27 49.15,136.27 50.8,134.62 50.8,129.54 49.78,128.52 PCIR-9.2
PCI-10
  Top 0.4: PC-HL.10 42.29,105.16 44.96,107.82 44.96,126.24 PCIR-10.2
  Bottom 0.4: PCIR-10.2 42.93,128.27 46.99,128.27 49.28,130.56 49.28,134.37 48.39,135.25 37.34,135.25 34.29,138.3 PC-I-H.6
PCI-11
  Top 0.4: PC-HL.9 41.27,117.47 36.07,122.68 PCIR-11.2
  Bottom 0.4: PC-I-H.9 31.88,134.49 47.24,134.49 48.39,133.35 48.39,130.94 47.24,129.79 37.34,129.79 PCIR-11.2
PCI-12
  Top 0.4: PC-HH.15 22.61,92.46 26.92,96.77 26.92,125.98 PCIR-12.2
  Bottom 0.4: PC-I-H.12 26.67,129.54 27.69,128.52 PCIR-12.2
PCI-H-CP  (via drill 0.35)
  Top 0.4: JP1.1 8.89,123.19 13.97,128.27 v22.86,128.27
  Bottom 0.4: v22.86,128.27 22.86,130.81 PC-I-H.11
PCI-L-CP  (via drill 0.35)
  Top 0.4: JP1.2 19.05,127 25.4,127 28.07,129.67 47.37,129.67 48.26,130.56 v56.77,130.56 | v72.27,130.93 77.59,130.93 PC-I-L.11
  Bottom 0.4: v56.77,130.56 71.88,130.56 v72.26,130.94 v72.27,130.93
ROM-OE  (via drill 0.35)
  Top 0.4: ROM.20 81.28,31.75 80.64,32.38 80.64,35.94 81.53,36.83 ROM.22 | v33.02,36.83 12.7,36.83 8.89,40.64 8.89,106.68 11.43,109.22 JP1.8
  Bottom 0.4: ROM.20 78.74,27.94 41.91,27.94 v33.02,36.83
VCC  (via drill 0.35)
  Top 0.4: PC-LH.16 71.25,88.9 | PC-LH.4 78.23,97.92 79.38,96.77 79.38,89.41 78.87,88.9 71.25,88.9 | PC-HH.4 PC-HH.16 15.75,89.92 C6.+ | PC-I-H.20 57.66,132.08 | C4.+ 40.77,89.41 PC-HL.16 42.8,88.39 50.29,88.39 50.93,89.03 50.93,95.63 49.02,97.54 PC-HL.4 52.07,100.71 52.07,124.46 54.61,127 56.77,127 57.66,127.89 57.66,132.08 | 57.66,132.08 66.55,132.08 C2.+ | C1.+ 21.46,130.3 46.48,130.3 46.99,130.81 PC-I-H.20 | PC-I-H.1 PC-I-H.20 | PC-I-L.1 PC-I-L.20 109.47,132.08 112.01,129.54 112.01,127.64 111.38,127 107.95,127 105.79,124.84 105.79,99.06 104.65,97.92 PC-LL.4 104.52,97.92 105.66,96.77 105.66,89.66 104.9,88.9 97.79,88.9 96.39,90.3 PC-LL.16 | ROM.27 ROM.28 73.66,60.96 v73.66,67.31 | C7.+ 22.61,69.34 v22.61,77.47 | v73.66,81.28 71.25,83.69 71.25,88.9
  Bottom 0.4: PC-LL.16 87.63,90.3 | 87.63,90.3 86.23,90.3 78.61,97.92 PC-LH.4 | PC-HH.4 33.66,97.54 PC-HL.16 | PC-LH.16 59.69,90.3 | 59.69,90.3 55.75,90.3 50.8,95.25 50.8,96.52 49.78,97.54 PC-HL.4 | C3.+ 59.69,90.3 | C5.+ 87.88,90.55 87.63,90.3 | PC-O-L.20 23.37,28.7 C8.+ 25.4,35.05 25.4,36.83 27.56,38.99 27.56,61.34 26.67,62.23 PC-O-H.20 | C7.+ 23.37,64.26 PC-O-H.20 | v22.61,77.47 22.61,89.03 PC-HH.16 | v73.66,67.31 v73.66,81.28 | PC-O-H.20 24.13,60.96 7.62,60.96 JP3.2